# EAGLE design 9902_taipo (EAGLE 9.6.2)

## Sheet 1 of 2
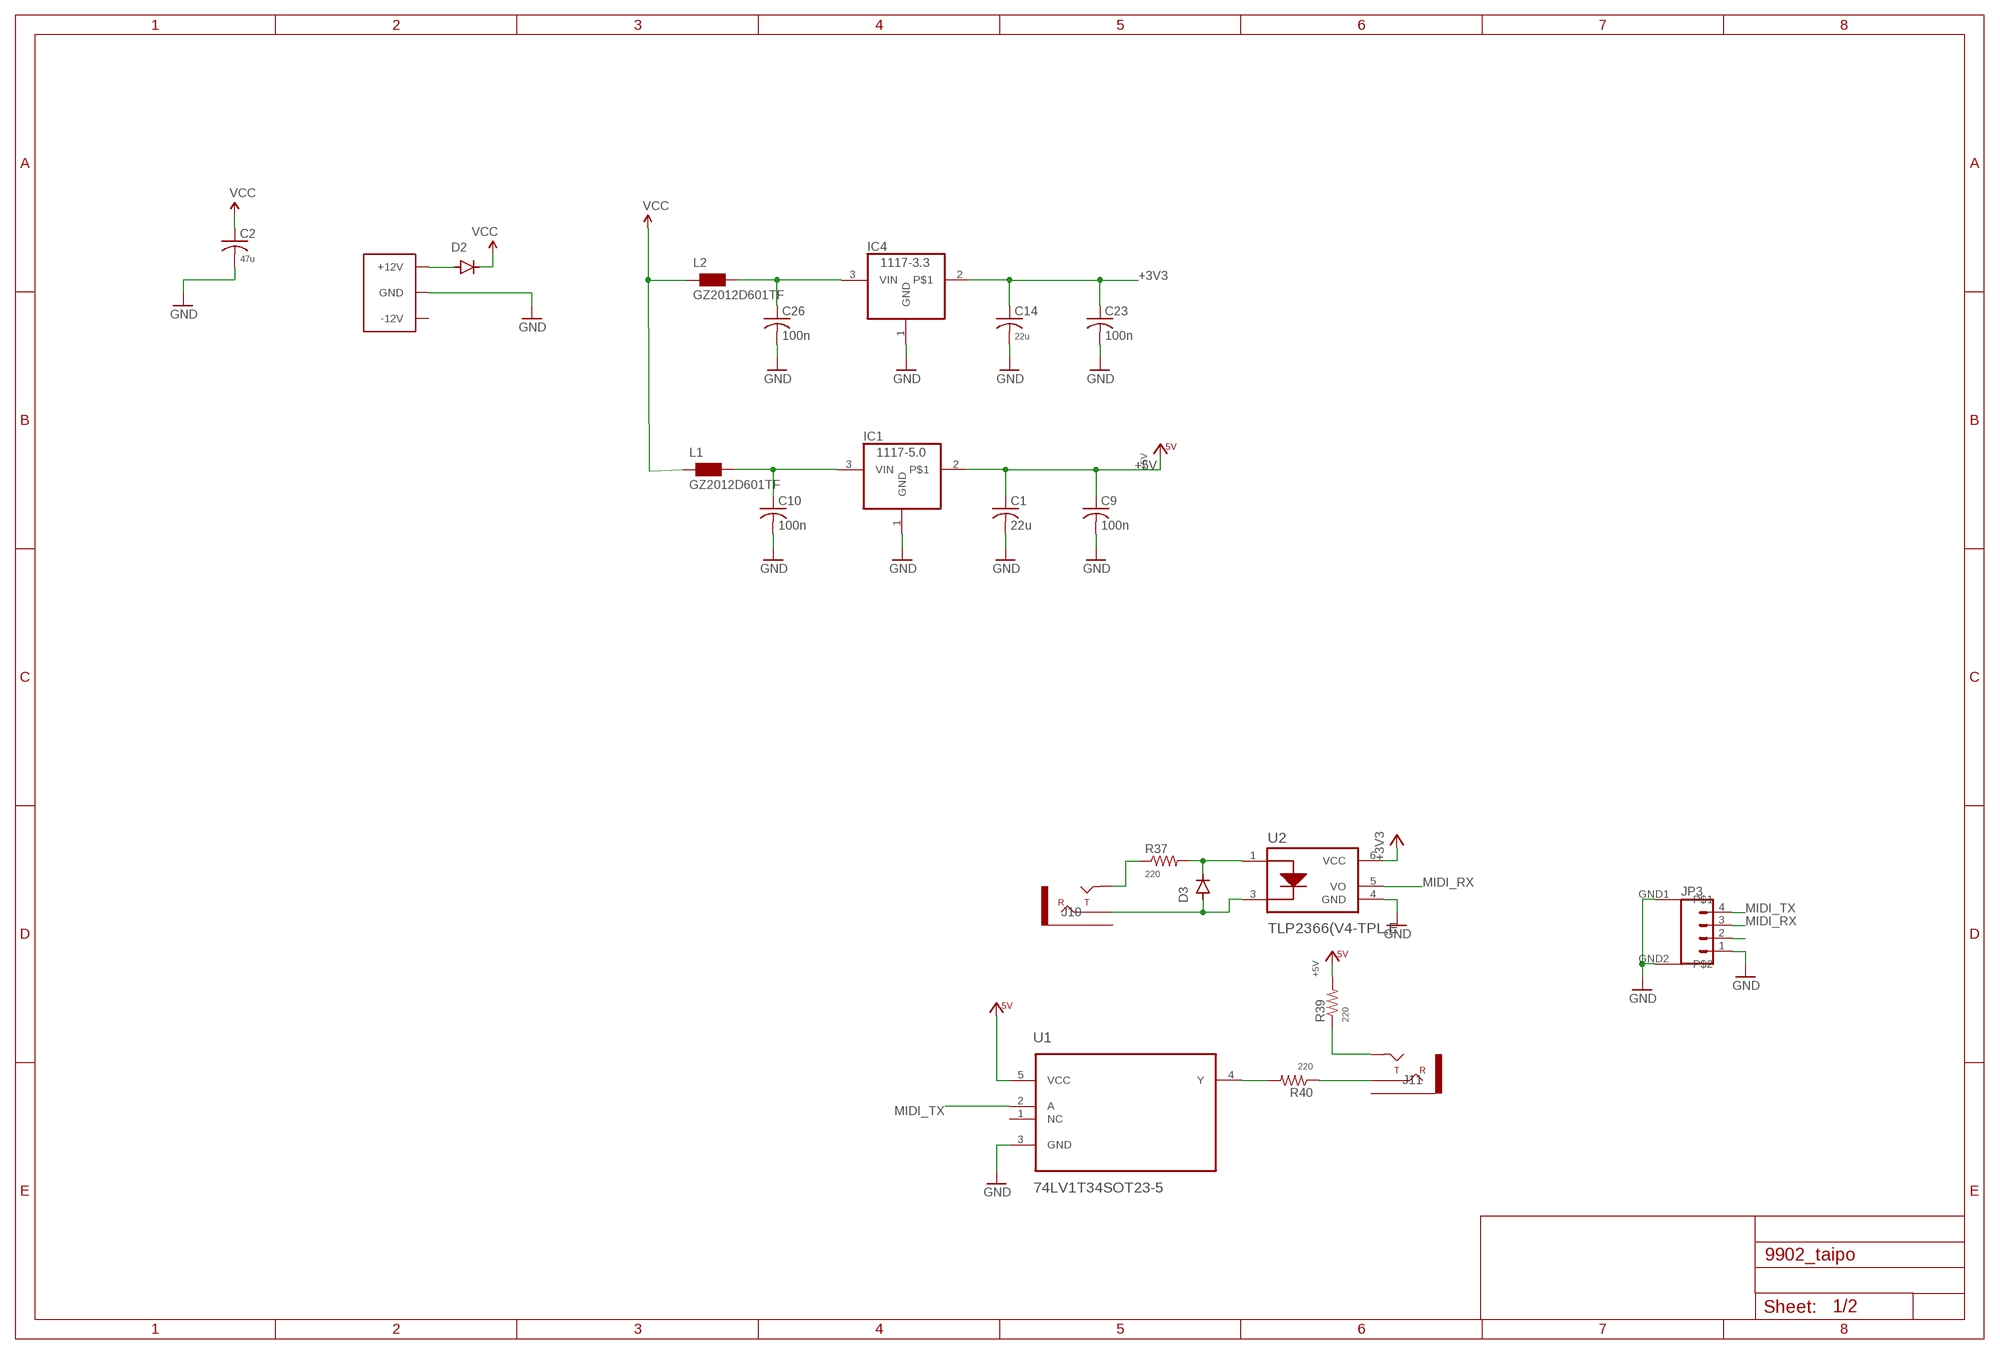
[diagram p0: schematic, sheet 1]

### Parts
C1  22u  C-USC0603  [C0603]
C2  47u  C-USC1206  [C1206]
C9  100n  C-USC0402  [C0402]
C10  100n  C-USC0402  [C0402]
C14  22u  C-USC0603  [C0603]
C23  100n  C-USC0402  [C0402]
C26  100n  C-USC0402  [C0402]
D2  1N5819HW  DIODE-SOD123  [SOD123]
D3  1N4148  DIODE-SOD323-R  [SOD323-R]
IC1  1117-5.0  LM1117  [SOT223]
IC4  1117-3.3  LM1117  [SOT223]
J10  PJ301CM  [PJ301CM]
J11  PJ301CM  [PJ301CM]
J21  EURO_POWER_LOCK  [EURO_PWR_HEADER_FAT]
JP3  M04A2001WF-4-SMD  [A2001WF-NA-4]
L1  GZ2012D601TF  WE-CBF_0805  [0805]
L2  GZ2012D601TF  WE-CBF_0805  [0805]
R37  220  R-US_R0402  [R0402]
R39  220  R-US_R0402  [R0402]
R40  220  R-US_R0402  [R0402]
U1  74LV1T34SOT23-5  [SOT23-5__SOT95P280X145-5N]
U2  TLP2366(V4-TPL,E  [OPTO_TLP2366(V4-TPL,E]

### Nets
+3V3: C14.1 C23.1 IC4.2 U2.6(VCC)
+5V: C1.1 C9.1 IC1.2 R39.2 U1.5(VCC)
DBG_PIN_2: JP3.2
GND: C1.2 C2.2 C9.2 C10.2 C14.2 C23.2 C26.2 IC1.1(GND) IC4.1(GND) J21.3(GND) J21.4(GND) J21.5(GND) J21.6(GND) J21.7(GND) J21.8(GND) JP3.1 JP3.GND1 JP3.GND2 U1.3(GND) U2.4(GND)
MIDI_RX: JP3.3 U2.5(VO)
MIDI_TX: JP3.4 U1.2(A)
N$18: R40.2 U1.4(Y)
N$36: D3.C R37.2 U2.1(ANODE)
N$37: D3.A J10.P$2(RING) U2.3(CATHODE)
N$38: J10.P$3(TIP) R37.1
N$39: J11.P$3(TIP) R39.1
N$40: J11.P$2(RING) R40.1
N$45: C10.1 IC1.3(VIN) L1.2
N$53: D2.A J21.9(+12V) J21.10(+12V)
N$88: C26.1 IC4.3(VIN) L2.2
VCC: C2.1 D2.C L1.1 L2.1
Unconnected: J10.P$1(EARTH) J11.P$1(EARTH) J21.1(-12V) J21.2(-12V) U1.1(NC)

## Sheet 2 of 2
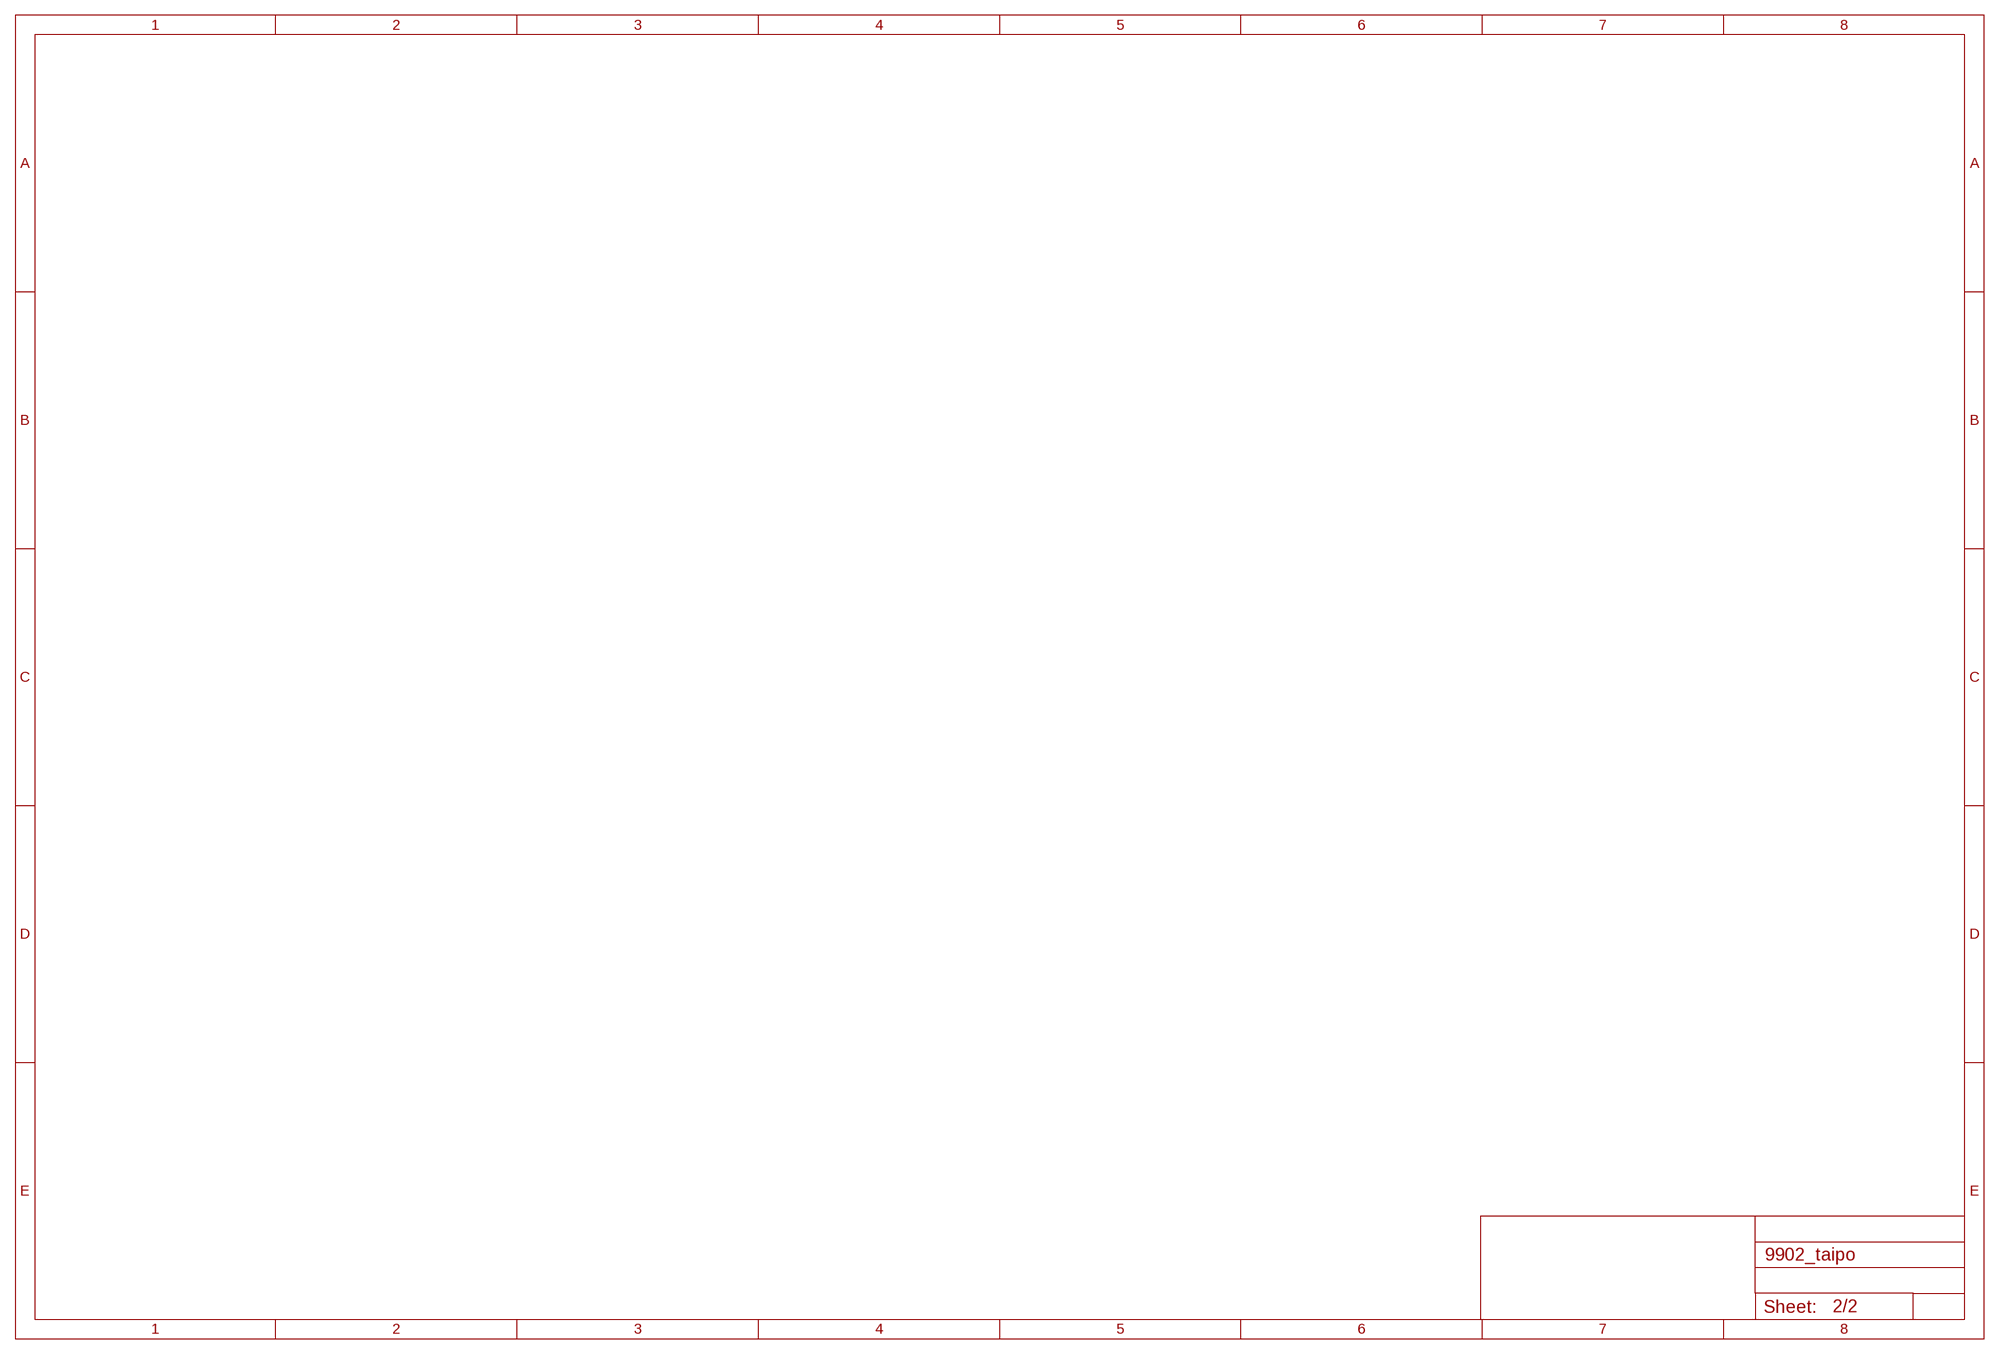
[diagram p1: schematic, sheet 2]

## Library data of the parts
C1 C2 C9 C10 C14 C23 C26 = 1voct_basic:C-US: CAPACITOR, American symbol
D2 D3 = diode:DIODE-: DIODE
IC1 IC4 = 1voct_basic:LM1117: 800mA and 1A Low Dropout (LDO) Positive Regulator 1.8V, 2.5V, 2.85V, 3.3V, 5V, and Adj
J10 J11 = 1voct_basic:PJ301CM
J21 = 1voct_eurorack:EURO_POWER_LOCK
JP3 = 1voct_basic:M04: Header 4 Standard 4-pin 0.1" header. Use with straight break away headers (SKU : PRT-00116), right angle break away headers (PRT-00553), swiss pins (PRT-00743), machine pins (PRT-00117), and female headers (PRT-00115). Molex polarized connector foot print use with SKU : PRT-08231 with associated crimp pins and housings.
L1 L2 = 1voct_basic:WE-CBF: SMD EMI Suppression Ferrite Beads - excellent anti-EMI properties - low DCR - impedances till 3000 ohms - rated current up to 6 A
R37 R39 R40 = 1voct_basic:R-US_: RESISTOR, American symbol
U1 = 1voct_basic:74LV1T34: Single Supply Translating Buffer
U2 = 1voct_basic:TLP2366(V4-TPL,E: Logic Output Optoisolator 20MBd Push-Pull, Totem Pole 3750Vrms 1 Channel 20kV/µs CMTI 6-SO, 5 Lead Check prices <https://pricing.snapeda.com/parts/TLP2366%28V4-TPL%2CE/Toshiba%20Semiconductor/view-part?ref=eda>; AVAILABILITY: In Stock; DESCRIPTION: Logic Output Optoisolator 20MBd Push-Pull, Totem Pole 3750Vrms 1 Channel 20kV/µs CMTI 6-SO, 5 Lead; MF: Toshiba Semiconductor; MP: TLP2366(V4-TPL,E; PACKAGE: SO-6 Toshiba Semiconductor; PRICE: None

## Board
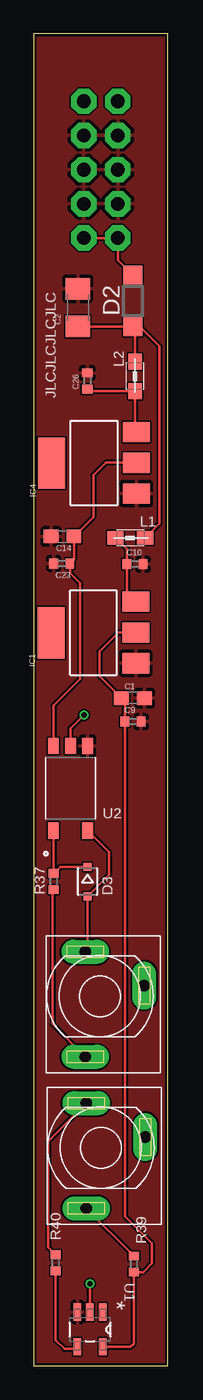
[diagram p2: board, top side]
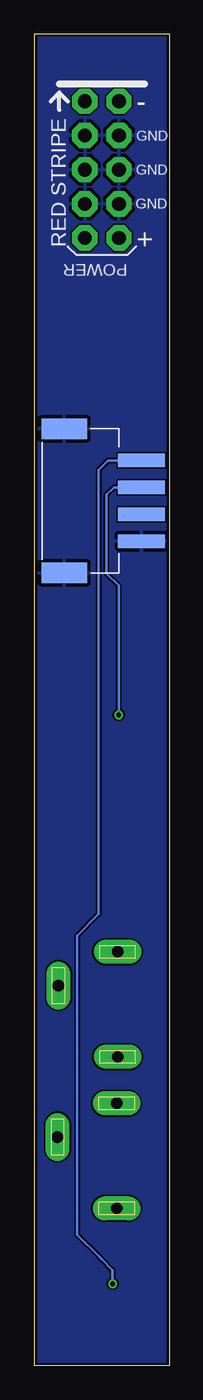
[diagram p3: board, bottom side, seen from below]

Size 10 x 98.95 mm. Coordinates in mm from the lower left corner, seen from the top.
Outline: 0,0 10,0 10,98.95 0,98.95 0,0
Copper layers (1*16): Top 0.035mm / dielectric 1.6mm / Bottom 0.035mm
Design rules "jlcpcb-2layers-1vo-v1": minimum track width 5mil, minimum drill 0.3mm, track to track 5mil, track to pad 5mil, pad to pad 5mil, via to via 5mil, smd to smd 5mil, copper to edge 0.2mm, drill to drill 6mil, minimum pad ring 6mil, minimum via ring 6mil, stop-mask expansion 4mil, vias tented up to drill 20mil, thermal gap 10mil

### Footprints (pad centres in the part's own frame; a part is rotated, then mirrored left to right if it is on the bottom)
C0603 = smd 1.1 x 1: 1 -0.85,0; 2 0.85,0
C1206 = smd 1.6 x 1.8: 1 -1.4,0; 2 1.4,0
C0402 = smd 0.65 x 0.75: 1 -0.6,0; 2 0.6,0
SOD123 = smd 1.4 x 1.4: A 1.9,0; C -1.9,0
SOD323-R = smd 0.6 x 0.6: A 1.1,0; C -1.1,0
SOT223 = smd 2.007 x 1.499: 1 3.15,-2.261; 2 3.15,0.025; 3 3.15,2.311 | smd 2.007 x 3.81: 4 -3.15,0
PJ301CM = drill 0.85 pad 1.778 long: P$1 3.3,0.8; P$2 -1.1,3.3; P$3 -1.1,-4.5
EURO_PWR_HEADER_FAT = drill 1.016 pad 1.88 octagon: 1 -5.08,-1.27; 2 -5.08,1.27; 3 -2.54,-1.27; 4 -2.54,1.27; 5 0,-1.27; 6 0,1.27; 7 2.54,-1.27; 8 2.54,1.27; 9 5.08,-1.27; 10 5.08,1.27
A2001WF-NA-4 = smd 3.5 x 1: 1 1.75,0; 2 1.75,2; 3 1.75,4; 4 1.75,6 | smd 3.4 x 1.5: GND1 -4,8.35; GND2 -4,-2.35
0805 = smd 1.2 x 1: 1 -1.1,0; 2 1.1,0
R0402 = smd 0.65 x 0.75: 1 -0.6,0; 2 0.6,0
SOT23-5__SOT95P280X145-5N = smd 1.27 x 0.559: 1 -1.295,0.94; 2 -1.295,0; 3 -1.295,-0.94; 4 1.295,-0.94; 5 1.295,0.94
OPTO_TLP2366(V4-TPL,E = smd 1.2 x 0.8: 1 -3.15,1.27; 3 -3.15,-1.27; 4 3.15,-1.27; 5 3.15,0; 6 3.15,1.27

### Placement (x,y rotation side)
C1  7.4,49.6 0 top
C2  3.3,78.6 90 top
C9  7.4,47.85 0 top
C10  7.55,59.55 0 top
C14  2.15,61.6 180 top
C23  2.1,59.6 180 top
C26  4,73.15 90 top
D2  7.4,79.1 90 top
D3  4.01,35.97 270 top
IC1  4.45,54.45 0 top
IC4  4.5,67.05 0 top
J10  4.94,27.45 0 top
J11  5.01,16.2 0 top
J21  5,88.85 270 bottom
JP3  3.8,61.25 0 bottom
L1  7.2,61.5 180 top
L2  7.55,73.5 270 top
R37  1.49,35.97 90 top
R39  7.46,7.56 270 top
R40  1.65,7.65 270 top
U1  4.2,2.7 270 top
U2  2.75,42.9 90 top

### Tracks (layer width: path | path; a pad name or v marks a point on that pad's centre or on a via)
+3V3
  Top 0.2: IC4.2 5.38,67.08 4.45,66.15 4.45,63.05 C14.1 3,59.9 C23.1 2.7,58.9 3.45,58.15 3.45,51 1.48,49.03 U2.6
+5V
  Top 0.2: IC1.2 6.33,54.48 4.9,53.05 4.9,51.25 C1.1 6.8,49.35 C9.1 6.8,11.1 8.8,9.1 8.8,7.6 8.16,6.96 R39.2 7.46,1.66 7.21,1.4 U1.5
GND
  pour Top: 0,99.05 10,99.05 10,0.05 0,0.05
  pour Bottom: 0,99.05 9.9,99.05 9.9,0.15 0,0.15
MIDI_RX  (via drill 0.35)
  Top 0.2: U2.5 2.75,47.35 v3.75,48.35
  Bottom 0.2: v3.75,48.35 3.75,57.95 4.65,58.85 4.65,64.7 4.1,65.25 JP3.3
MIDI_TX  (via drill 0.35)
  Top 0.2: U1.2 v4.2,6.1
  Bottom 0.2: JP3.4 4.55,67.25 5.25,66.55 5.25,33.55 6.85,31.95 6.85,9.75 5.2,8.1 5.05,7.95 4.2,7.1 v4.2,6.1
N$18
  Top 0.2: R40.2 1.65,1.9 2.3,1.25 3.11,1.25 U1.4
N$36
  Top 0.2: U2.1 1.48,36.58 R37.2 1.99,37.07 D3.C
N$37
  Top 0.2: U2.3 5.6,38.17 5.6,36.45 D3.A 4.01,30.92 J10.P$2
N$38
  Top 0.2: R37.1 1.4,35.28 1.4,25.39 J10.P$3
N$39
  Top 0.2: R39.1 J11.P$3
N$40
  Top 0.2: J11.P$2 1.1,16.69 1.1,8.81 R40.1
N$45
  Top 0.2: L1.2 6.95,60.65 C10.1 6.95,57.41 IC1.3
N$53
  Top 0.2: D2.A 6.27,82.13 J21.9 J21.10
N$88
  Top 0.2: IC4.3 7.55,69.46 L2.2 4.15,72.4 C26.1
VCC
  Top 0.2: 7.55,77.05 D2.C C2.1 | 7.55,77.05 7.55,77.55 9.35,75.75 9.35,62.55 L1.1 | 7.55,77.05 L2.1

### Text on the board
tPlace: JLCJLCJLCJLC